# EAGLE design Sensorsboard (EAGLE 9.2.2)
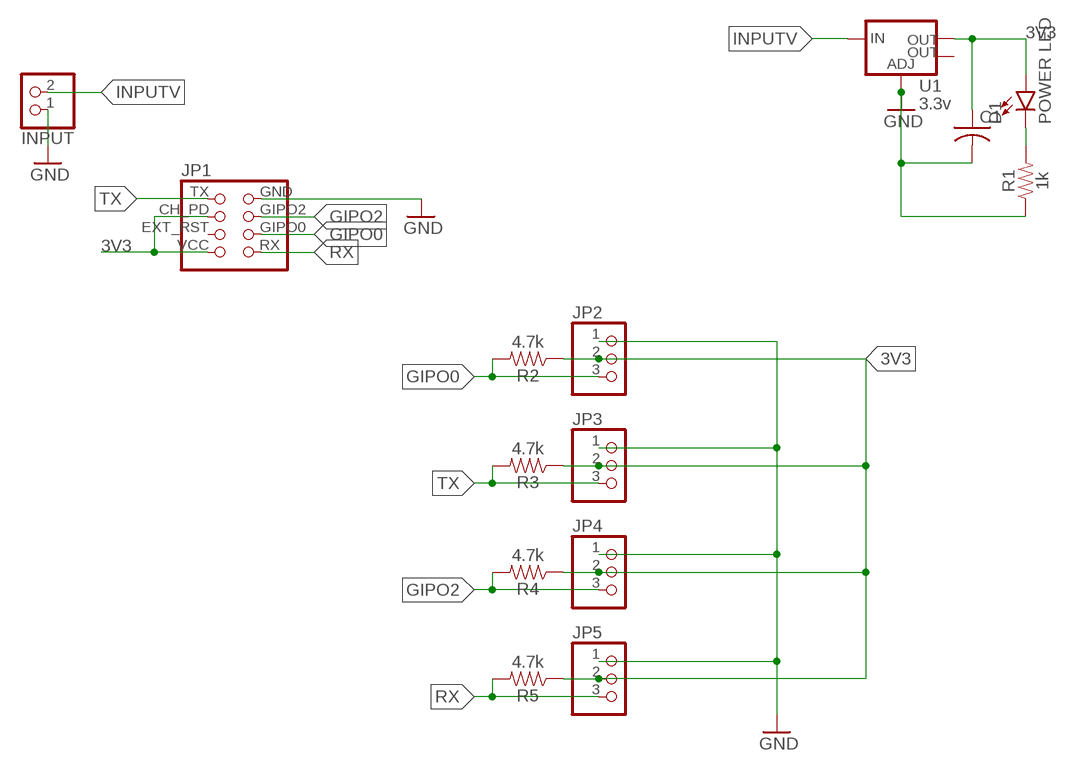
[diagram p0: schematic, sheet 1]

## Parts
C1  C-USC1206K  [C1206K]
D1  POWER LED  LED-BLUE0805  [LED-0805]
INPUT  PINHD-1X2  [1X02]
JP1  ESP-01-FEMALE  [ESP-01-FEMALE]
JP2  PINHD-1X3  [1X03]
JP3  PINHD-1X3  [1X03]
JP4  PINHD-1X3  [1X03]
JP5  PINHD-1X3  [1X03]
R1  1k  RESISTOR0805  [0805]
R2  4.7k  RESISTOR0805  [0805]
R3  4.7k  RESISTOR0805  [0805]
R4  4.7k  RESISTOR0805  [0805]
R5  4.7k  RESISTOR0805  [0805]
U1  3.3v  V_REG_LM1117SOT223  [SOT223]

## Nets
3V3: C1.1 D1.+(A) JP1.CH_PD(CHIP_EN) JP1.VCC JP2.2 JP3.2 JP4.2 JP5.2 R2.1 R3.1 R4.1 R5.1 U1.2(OUT)
GIPO0: JP1.GIPO0 JP2.3 R2.2
GIPO2: JP1.GIPO2 JP4.3 R4.2
GND: C1.2 INPUT.1 JP1.GND JP2.1 JP3.1 JP4.1 JP5.1 R1.1 U1.1(ADJ)
INPUTV: INPUT.2 U1.3(IN)
N$5: D1.-(C) R1.2
RX: JP1.RX JP5.3 R5.2
TX: JP1.TX JP3.3 R3.2
Unconnected: JP1.EXT_RST U1.4(OUT)

## Library data of the parts
C1 = simple-shiled:C-US: CAPACITOR, American symbol
D1 = simple-shiled:LED-BLUE: Blue SMD LED Used in manufacturing of various products at SparkFun Packages: 0603 - SMD 0603 package [Product Link] <http://www.digikey.com/product-detail/en/SMLE12BC7TT86/511-1589-2-ND/1641808> 1206 - SMD1206 package [Product Link] <http://www.digikey.com/product-detail/en/lite-on-inc/LTST-C150TBKT/160-1643-1-ND/573584> SparkFun Products: ESP8266 Thing-Dev Board <https://www.sparkfun.com/products/13711> RedBoard <https://www.sparkfun.com/products/12757>
INPUT = simple-shiled:PINHD-1X2: PIN HEADER
JP1 = simple-shiled:ESP-01-FEMALE: PIN HEADER
JP2-JP5 = simple-shiled:PINHD-1X3: PIN HEADER
R1-R5 = simple-shiled:RESISTOR: Generic Resistor Package
U1 = simple-shiled:V_REG_LM1117: Voltage Regulator LM1117 Standard adjustable voltage regulator but in SMD form. Spark Fun Electronics SKU : COM-00595; PROD_ID: VREG-08170

## Board
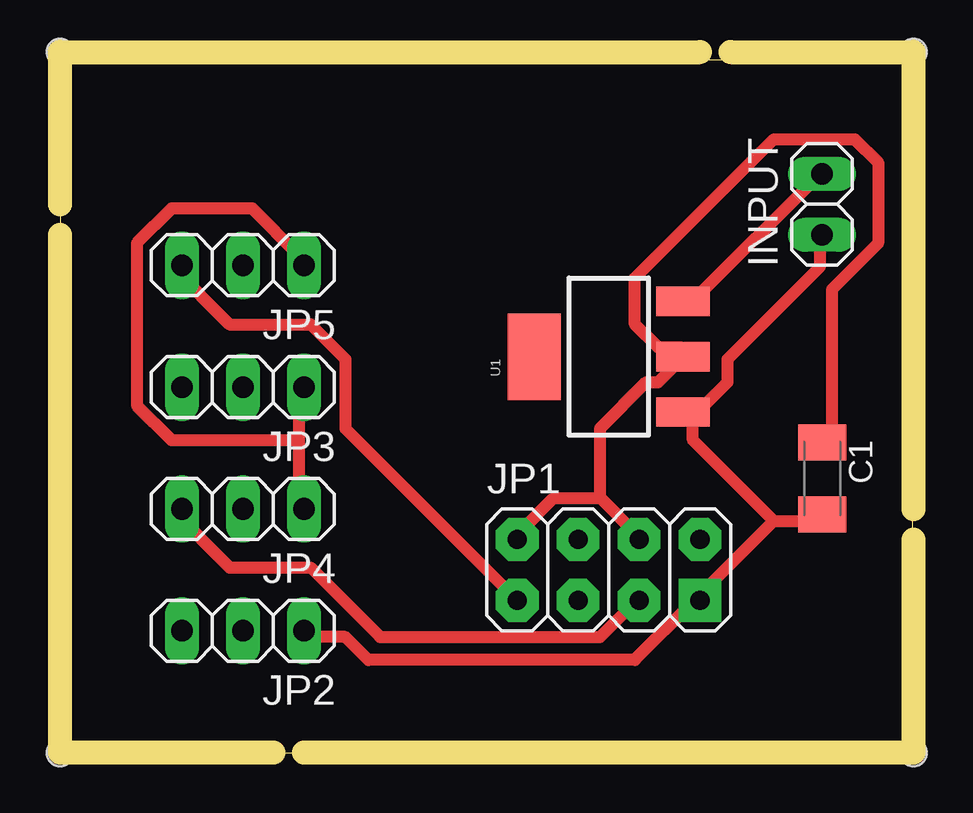
[diagram p1: board, top side]
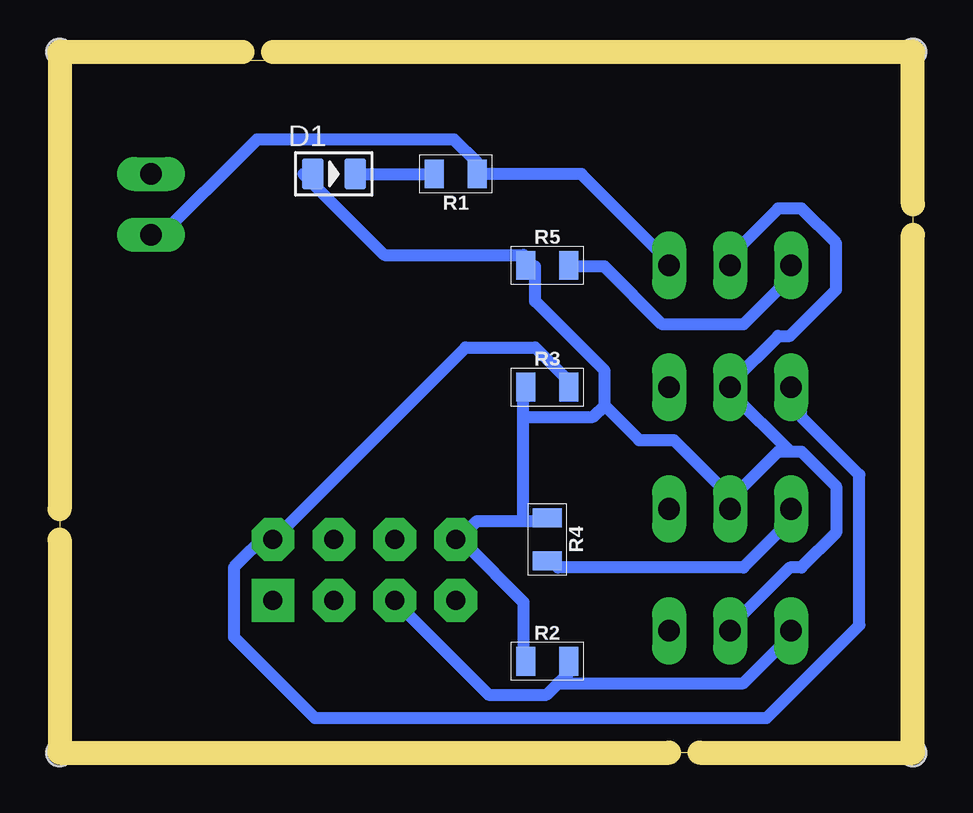
[diagram p2: board, bottom side, seen from below]

Size 35.54 x 28.88 mm. Coordinates in mm from the lower left corner, seen from the top.
Outline: 0,0 35.54,0 35.54,28.88 0,28.88 0,0
Copper layers (1*16): Top 0.035mm / dielectric 1.5mm / Bottom 0.035mm
Design rules "prototype": minimum track width 20mil, minimum drill 0.35mm, track to track 18mil, track to pad 15mil, pad to pad 20mil, via to via 40mil, smd to smd 6mil, copper to edge 20mil, drill to drill 20mil, minimum pad ring 10mil, minimum via ring 1mm, stop-mask expansion 4mil, vias tented up to drill 0mil, thermal gap 10mil
Holes 1.1 mm at 0,0 35.56,0 35.56,29.21 0,29.21
Milling: 8 lines

### Footprints (pad centres in the part's own frame; a part is rotated, then mirrored left to right if it is on the bottom)
C1206K = smd 1.5 x 2: 1 -1.5,0; 2 1.5,0
LED-0805 = smd 0.889 x 1.27: + -0.889,0; - 0.889,0
1X02 = drill 0.9 long: 1 -1.27,0; 2 1.27,0
ESP-01-FEMALE = drill 0.8 pad 1.778 octagon: CH_PD 1.27,1.27; EXT_RST -1.27,1.27; GIPO0 -1.27,-1.27; GIPO2 1.27,-1.27; RX -3.81,-1.27; TX 3.81,1.27; VCC -3.81,1.27 | drill 0.8 pad 1.778 square: GND 3.81,-1.27
1X03 = drill 0.9 long: 1 -2.54,0; 2 0,0; 3 2.54,0
0805 = smd 0.8 x 1.2: 1 -0.9,0; 2 0.9,0
SOT223 = smd 1.219 x 2.235: 1 -2.311,-3.099; 2 0,-3.099; 3 2.311,-3.099 | smd 3.6 x 2.2: 4 0,3.099

### Placement (x,y rotation side)
C1  31.75,11.43 270 top
D1  24.13,24.13 0 bottom
INPUT  31.75,22.86 90 top
JP1  22.86,7.62 0 top
JP2  7.62,5.08 180 top
JP3  7.62,15.24 180 top
JP4  7.62,10.16 180 top
JP5  7.62,20.32 180 top
R1  19.05,24.13 180 bottom
R2  15.24,3.81 0 bottom
R3  15.24,15.24 0 bottom
R4  15.24,8.89 270 bottom
R5  15.24,20.32 0 bottom
U1  22.86,16.51 90 top

### Tracks (layer width: path | path; a pad name or v marks a point on that pad's centre or on a via)
3V3
  Top 0.508: C1.1 32.16,13.03 32.16,19.3 34.09,21.23 34.09,24.61 33.12,25.58 29.74,25.58 23.95,19.79 23.95,17.86 24.92,16.89 25.88,16.89 U1.2 25.88,16.41 24.92,15.44 24.43,15.44 22.5,13.51 22.5,10.62 | 22.5,10.62 23.95,9.17 JP1.CH_PD | 22.5,10.62 20.57,10.62 19.13,9.17 JP1.VCC
  Bottom 0.508: 5.13,12.55 5.61,12.55 7.54,10.62 JP4.2 8.03,10.62 8.03,11.1 9.96,13.03 11.4,13.03 12.85,14.48 | 5.13,12.55 4.65,12.55 3.2,11.1 3.2,9.17 4.65,7.72 5.13,7.72 7.54,5.31 JP2.2 | 5.13,12.55 7.54,14.96 JP3.2 7.54,15.44 5.61,17.37 5.13,17.37 3.2,19.3 3.2,21.23 4.65,22.68 5.61,22.68 7.54,20.75 JP5.2 | D1.+ 25.4,24.13 22.02,20.75 16.23,20.75 R5.1 15.75,20.27 15.75,18.82 12.85,15.93 12.85,14.48 | 16.23,9.65 18.16,9.65 18.64,9.17 JP1.VCC 18.64,8.69 16.23,6.27 16.23,3.86 R2.1 | 16.23,9.65 15.27,9.65 R4.1 | 16.23,9.65 16.23,13.99 | 16.23,13.99 16.23,14.96 R3.1 | 12.85,14.48 13.34,13.99 16.23,13.99
GIPO0
  Bottom 0.508: 14.78,2.9 15.27,2.41 17.68,2.41 21.54,6.27 JP1.GIPO0 | 14.78,2.9 14.3,3.38 R2.2 | 14.78,2.9 7.06,2.9 5.13,4.83 JP2.3
GIPO2
  Top 0.508: JP1.GIPO2 23.95,6.27 22.5,4.83 13.34,4.83 10.44,7.72 7.06,7.72 4.65,10.13 JP4.3
  Bottom 0.508: R4.2 14.78,7.72 7.06,7.72 4.65,10.13 JP4.3
GND
  Top 0.508: 9.96,13.03 9.96,14.96 JP3.1 | 9.96,13.03 9.96,10.62 JP4.1 | 9.96,13.03 4.65,13.03 3.2,14.48 3.2,21.23 4.65,22.68 8.03,22.68 9.96,20.75 JP5.1 | 29.74,9.65 31.67,9.65 C1.2 | 29.74,9.65 26.85,6.76 JP1.GND 26.36,6.27 23.95,3.86 12.85,3.86 11.89,4.83 10.44,4.83 JP2.1 | 26.36,13.99 26.36,13.03 29.74,9.65 | 26.36,13.99 27.81,15.44 27.81,16.41 31.67,20.27 31.67,21.23 INPUT.1 | 26.36,13.99 U1.1
  Bottom 0.508: JP5.1 10.44,20.75 13.82,24.13 R1.1 18.16,24.13 18.16,24.61 19.13,25.58 27.33,25.58 31.67,21.23 INPUT.1
INPUTV
  Top 0.508: U1.3 26.36,18.82 31.67,24.13 INPUT.2
N$5
  Bottom 0.508: D1.- R1.2
RX
  Top 0.508: JP1.RX 11.89,13.51 11.89,16.41 10.44,17.86 7.06,17.86 4.65,20.27 JP5.3
  Bottom 0.508: R5.2 14.3,20.27 12.85,20.27 10.44,17.86 7.06,17.86 4.65,20.27 JP5.3
TX
  Bottom 0.508: R3.2 14.3,15.44 15.75,16.89 18.64,16.89 26.36,9.17 JP1.TX 26.85,9.17 28.3,7.72 28.3,4.83 24.92,1.45 6.1,1.45 2.23,5.31 2.23,11.58 4.65,13.99 4.65,14.96 JP3.3